# Altium schematic sheet buck_converter.SchDoc
size A4
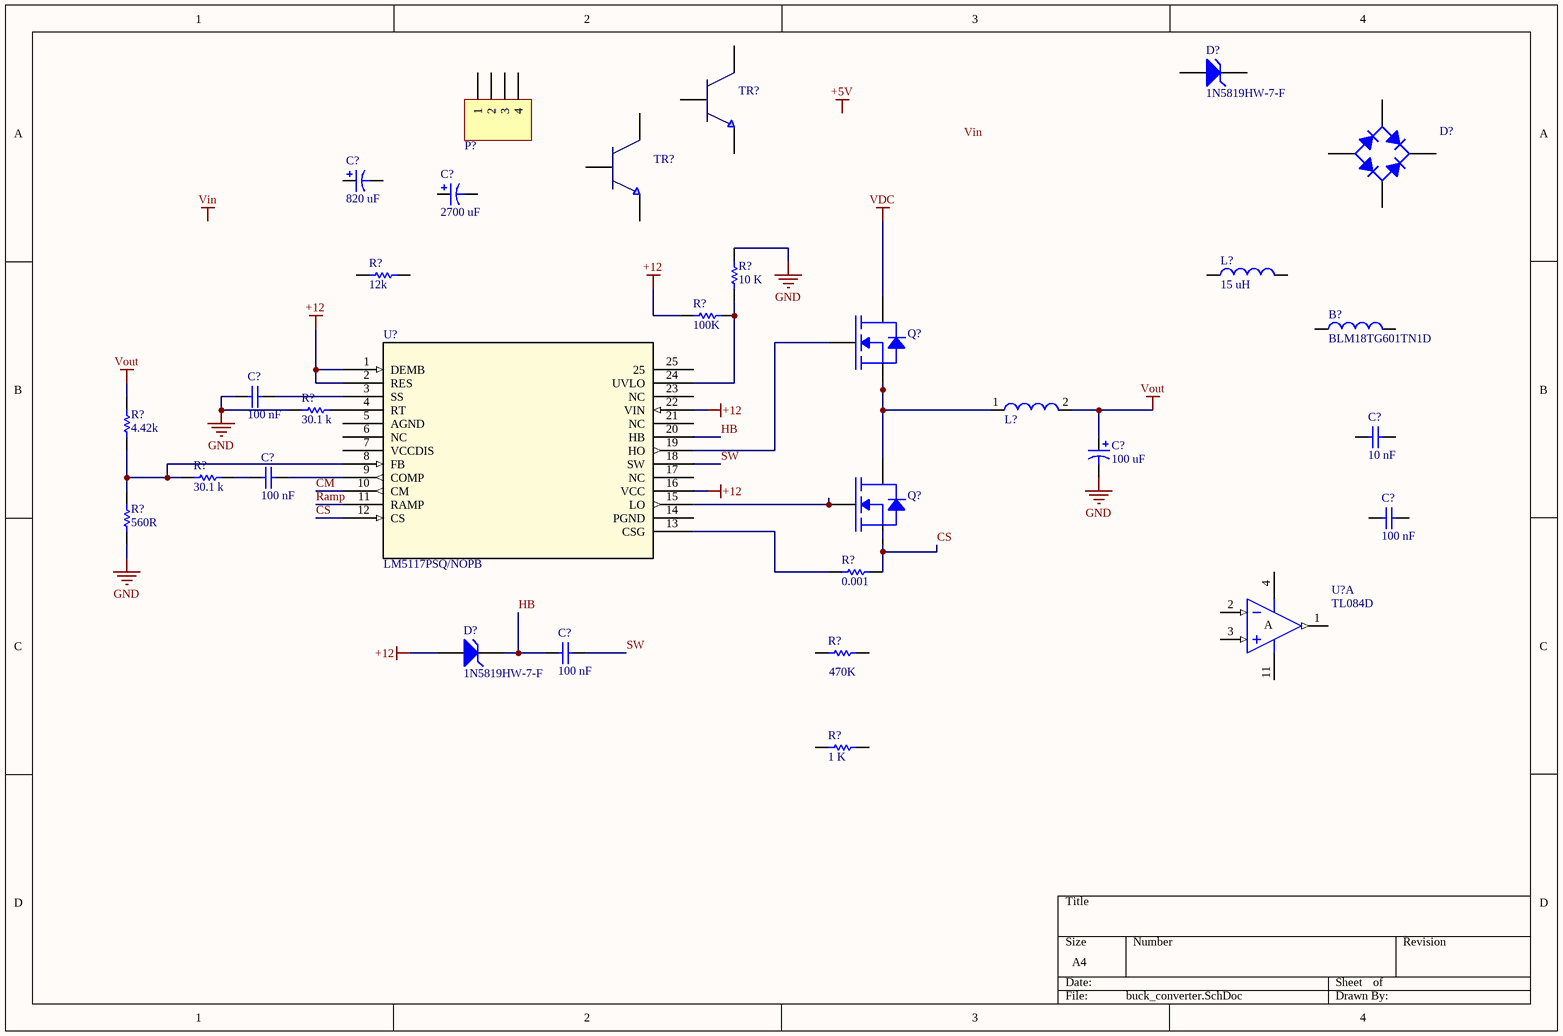
[diagram p0: buck_converter.SchDoc]

## Parts
(Parts that share a designator on the sheet are numbered #1, #2 ... from top to bottom, then left to right.)
B?  BLM18TG601TN1D  [0603]
C?#1  value 820 uF  [ESMQ401VSN821MA45S]  (hidden comment: ESMQ401VSN821MA45S)
C?#2  value 2700 uF  [ALC70C272FP400]  (hidden comment: ALC70C272FP400)
C?#3  value 100 nF  [0402]  (hidden comment: GRM155R61E104KA87D)
C?#4  value 10 nF  [0402]  (hidden comment: GRM155R71E103JA01D)
C?#5  value 100 uF  [CAP-6.3X11]  (hidden comment: ECA-1VM101)
C?#6  value 100 nF  [0603]  (hidden comment: 06033C104KAT4A)
C?#7  value 100 nF  [0402]  (hidden comment: GRM155R61E104KA87D)
C?#8  value 100 nF  [0402]  (hidden comment: GRM155R61E104KA87D)
D?#1  1N5819HW-7-F  [SOD123]
D?#2  MB6S  [SOIC-4]  (value not drawn)
D?#3  1N5819HW-7-F  [SOD123]
L?#1  value 15 uH  [SRN4012T-150M]  (hidden comment: SRN4012T-150M)
L?#2  ATCA-08-251M-V  [ATCA-08-251M-V-w3d]  (value not drawn)
P?  CTB9358/4AO  [CTB9350/4AO]  (value not drawn)
Q?#1  LSIC1MO120E0080  [TO-247-3L]  (value not drawn)
Q?#2  LSIC1MO120E0080  [TO-247-3L]  (value not drawn)
R?#1  value 12k  [0603]  (hidden comment: Resistor)
R?#2  value 10 K  [0603]  (hidden comment: ERJ3GEYJ103V)
R?#3  value 100K  [0603]  (hidden comment: MC0063W06031100K)
R?#4  value 30.1 k  [0603]  (hidden comment: MC0063W0603130K1)
R?#5  value 4.42k  [0603]  (hidden comment: Resistor)
R?#6  value 30.1 k  [0603]  (hidden comment: MC0063W0603130K1)
R?#7  value 560R  [AC05000005600JAC00 - 2]  (hidden comment: AC05000005600JAC00)
R?#8  value 0.001  [3921]  (hidden comment: PSR400ITQFH1L00)
R?#9  value 470K  [0204]  (hidden comment: MMA02040C4703FB300)
R?#10  value 1 K  [0402]  (hidden comment: ERJ2GEJ102X)
TR?#1  Transistor  [SOT23_3 - fmm]  (value not drawn)
TR?#2  Transistor  [SOT23_N]  (value not drawn)
U?#1  LM5117PSQ/NOPB  [SQA24A]
U?#2  TL084D  [D014_N]  (part A of 4)

## Nets
+12: D?#3.1(A) R?#3.1 U?#1.1(DEMB) U?#1.2(RES) U?#1.16(VCC) U?#1.22(VIN)
GND: C?#3.1 C?#5.2 R?#2.2 R?#4.2 R?#7.1
VDC: Q?#1.2(D(Tab))
Vout: C?#5.1 L?#2.2 R?#5.2
CM: U?#1.10(CM)
CS: Q?#2.3(S) R?#8.1 U?#1.12(CS)
HB: C?#8.1 D?#3.2(K) U?#1.20(HB)
Ramp: U?#1.11(RAMP)
SW: C?#8.2 U?#1.18(SW)
NetC?#3_2: C?#3.2 U?#1.3(SS)
NetC?#6_1: C?#6.1 R?#6.1
NetC?#6_2: C?#6.2 U?#1.9(COMP)
NetL?#2_1: L?#2.1 Q?#1.3(S) Q?#2.2(D(Tab))
NetQ?#1_1: Q?#1.1(G) U?#1.19(HO)
NetQ?#2_1: Q?#2.1(G) U?#1.15(LO)
NetR?#2_1: R?#2.1 R?#3.2 U?#1.24(UVLO)
NetR?#4_1: R?#4.1 U?#1.4(RT)
NetR?#5_1: R?#5.1 R?#6.2 R?#7.2 U?#1.8(FB)
NetR?#8_2: R?#8.2 U?#1.13(CSG)

Not connected (* = marked no-connect by the designer): B? 1 2; C?#1 1 2; C?#2 1 2; C?#4 1 2; C?#7 1 2; D?#1 1(A) 2(K); D?#2 1(+) 2(-) 3(AC) 4(AC); L?#1 1 2; P? 1 2 3 4; R?#1 1 2; R?#9 1 2; R?#10 1 2; TR?#1 1 2 3; TR?#2 1 2 3; U?#1 5(AGND) 6(NC) 7(VCCDIS) 14(PGND) 17(NC) 21(NC) 23(NC) 25; U?#2 1(OUT) 2(IN-) 3(IN+) 4(V+) 11(V-)

## Notes on the sheet
- Labels drawn without touching a wire or pin: +5V, Vin
- (in symbol TL084D, part A) A

## Library data of the parts
B? = BLM18TG601TN1D: 600 Ohm, 200 mA ferrite bead; Published: 10.03.2015; LatestRevisionDate: 08.03.2016; Publisher: Sinan; Package Reference: 0603; Supplier: Digi-Key; Supplier No: 490-9702-2-ND
C?#1 = ESMQ401VSN821MA45S: CAP ALUM 820UF 20% 400V SNAP; Published: 25.10.2016; LatestRevisionDate: -; Publisher: Baris; PackageDescription: Polarized Capacitor; 2 Leads; Supplier: Digikey; Supplier No: 565-2783-ND
C?#2 = ALC70C272FP400: SNAP-IN HIGH CV 85C 2700UF 400V; Published: 25.10.2019; LatestRevisionDate: -; Publisher: Baris; PackageDescription: SNAP-IN HIGH CV 85C 2700UF 400V; Supplier: Digikey; Supplier No: 399-19622-ND
C?#3 C?#7 C?#8 = GRM155R61E104KA87D: 100 nF X5R Ceremic Capacitor; Montaj Bilgisi: Otomatik; Published: 25.07.2016; LatestRevisionDate: 25.07.2016; Publisher: Sinan; PackageDescription: 0402[1005] package smd; Supplier: Farnell; Supplier No: 2470465
C?#4 = GRM155R71E103JA01D: 10 nF X7R Ceremic Capacitor; Montaj Bilgisi: Otomatik; Published: 25.07.2016; LatestRevisionDate: 25.07.2016; Publisher: Sinan; PackageDescription: 0402[1005] package smd; Supplier: Farnell; Supplier No: 1572614RL
C?#5 = ECA-1VM101: 100 uF 35V Electrlytic capacitor; Published: 25.10.2016; LatestRevisionDate: -; Publisher: Sinan; PackageDescription: Polarized Capacitor; 2 Leads; Supplier: Farnell; Supplier No: 2550295
C?#6 = 06033C104KAT4A: 100 nF X7R Ceremic Capacitor; Published: 29.10.2015; LatestRevisionDate: 29.10.2015; Publisher: Sinan; PackageDescription: 0603[1608] package smd; Supplier: Digi-Key; Supplier No: 478-7018-2-ND
D?#1 D?#3 = 1N5819HW-7-F: Diode Schottky 40V 1A Surface Mount SOD-123; Published: 20.09.2019; Publisher: Baris; Manufacturer: 1N5819HW-7-F; Supplier No: 1N5819HW-FDICT-ND
D?#2 = MB6S: Full Wave Diode Bridge; Published: 30.10.2015; LatestRevisionDate: 30.10.2015; Publisher: Sinan; PackageDescription: Bridge Rectifier; 4 Terminals
L?#1 = SRN4012T-150M: 650 mA Semi-shielded inductor; Published: 24.10.2016; Publisher: Sinan
L?#2 = ATCA-08-251M-V: FIXED IND 250UH 10A 27 MOHM TH; Manufacturer Part Name: ATCA-08-251M-V; Supplier: Digikey; Supplier No: 535-13513-ND
P? = CTB9358/4AO: 4 pos plıggable terminal; LatestRevisionDate: 19.05.2016; Publisher: Sinan
Q?#1 Q?#2 = LSIC1MO120E0080: LittleFuse SIC mosfet; Published: 15.09.2019; LatestRevisionDate: 15.09.2019; Publisher: Baris; Package Reference: TO-247-3L; Supplier: Mouser; Supplier No: 576-LSICMO120E0080
R?#1 = MC0063W0603112K: 12k ohm 0603 package resistor; Montaj Bilgisi: Auto; Published: 16.06.2016; Publisher: Sinan; PackageDescription: 0603 [1608]; Supplier: Farnell; Supplier No: 2130943
R?#2 = ERJ3GEYJ103V: 10k ohm 0603 package resistor; Tolerance: 5%; Montaj Bilgisi: Otomatik; Published: 28.10.2015; LatestRevisionDate: 28.10.2015; Publisher: Sinan; PackageDescription: Surface mount 0603 package; Package Reference: 0603; Supplier: Digi-Key; Supplier No: P10KGTR-ND
R?#3 = MC0063W06031100K: 100Kohm 0603package resistor; Montaj Bilgisi: Auto; Published: 14.04.2016; Publisher: Baris; PackageDescription: 0603 [1608]; Supplier: Farnell; Supplier No: 9330402
R?#4 R?#6 = MC0063W0603130K1: 30.1k ohm 0603 package resistor; Tolerance: 1%; Montaj Bilgisi: Otomatik; Published: 14.05.2016; LatestRevisionDate: 14.05.2016; Publisher: Sinan; PackageDescription: Surface mount 0603 package; Package Reference: 0603; Supplier: Farnell; Supplier No: 1170935
R?#5 = MC0063W060314K42: 4.42k ohm 0603 package resistor; Montaj Bilgisi: Auto; Published: 16.06.2016; Publisher: Sinan; PackageDescription: 0603 [1608]; Supplier: Farnell; Supplier No: 1170853
R?#7 = AC05000005600JAC00: RES 560 OHM 5W 5% AXIAL; Published: 19.06.2016; Publisher: Baris; PackageDescription: dip; Supplier: Digikey; Supplier No: PPC5W560CT-ND
R?#8 = PSR400ITQFH1L00: 1 mOhms ±1% 4W Chip Resistor Nonstandard Automotive AEC-Q200, Current Sense Metal Element; Montaj Bilgisi: Otomatik; Published: 16.09.2019; LatestRevisionDate: 16.09.2019; Publisher: Baris; PackageDescription: Surface mount 3921 package; Tolerance: 1%; Package Reference: 3921; Supplier: Digi-Key; Supplier No: RHM1676-CT-ND
R?#9 = MMA02040C4703FB300: RES SMD 470K OHM 1% 0.4W 0204; Tolerance: %1; Published: 15.09.2019; LatestRevisionDate: 15.09.2019; Publisher: Baris; Package Reference: MELF, 0204; Supplier: Digikey; Supplier No: MMA-470KACT-ND
R?#10 = ERJ2GEJ102X: 1k ohm 0402 package resistor; Tolerance: 5%; Montaj Bilgisi: Otomatik; Published: 28.10.2015; LatestRevisionDate: 28.10.2015; Publisher: Sinan; PackageDescription: Surface mount 0402 package; Package Reference: 0402; Supplier: Digi-Key; Supplier No: P1.0KJTR-ND
TR?#1 = FMMT495CT-ND: Bipolar (BJT) Transistor NPN 150V 1A 100MHz 500mW Surface Mount SOT-23-3; Manufacturer Part Name: FMMT495TA; Montaj Bilgisi: Auto; Published: 25-12-2016; Publisher: Baris; Supplier: Digikey; Supplier No: FMMT495CT-ND
TR?#2 = BC846ALT1G: Bipolar (BJT) Transistor NPN 65V 100mA 100MHz 300mW Surface Mount SOT-23-3 (TO-236); Montaj Bilgisi: Auto; Published: 25-12-2016; Publisher: Baris; Manufacturer Part Name: BC846ALT1G
U?#1 = LM5117PSQ/NOPB: Wide Input Range Synchronous Buck Controller with Analog Current Monitor; Manufacturer: Texas Instruments; basePN: LM5117; DatasheetURL: http://www.ti.com/lit/ds/symlink/lm5117.pdf; NSC_PackageReference: SQA24A; Manufacturer_Part_Number: LM5117PSQ/NOPB; Vendor: Texas Instruments; Copyright: Copyright (C) 2018 Accelerated Designs. All rights reserved; RefDes: RefDes; Type: DEV
U?#2 = TL084D: JFET-Input Operational Amplifier; Published: 16-Jan-2001; LatestRevisionDate: 13-Apr-2006; Publisher: Altium Limited; PackageDescription: 14-Pin Small Outline Integrated Circuit 1.27 mm Pitch; Package Reference: D014